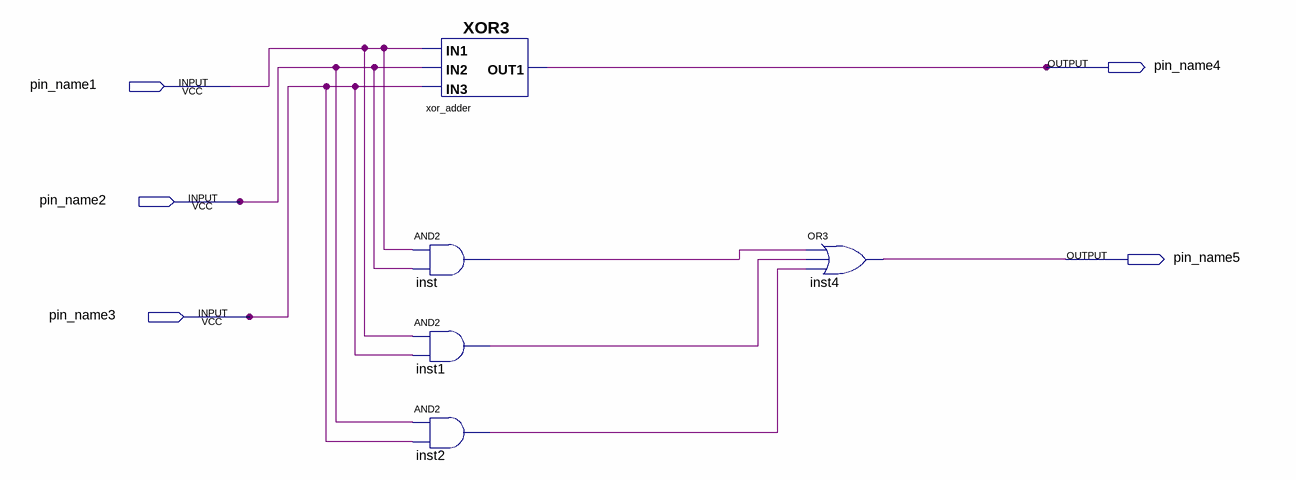
[diagram p0: schematic sheet]
// Quartus schematic full_adder_one_bit.bdf as structural Verilog: 5 symbols, 5 pins
module full_adder_one_bit (
  input  pin_name1,
  input  pin_name2,
  input  pin_name3,
  output pin_name4,
  output pin_name5
);

  wire inst1_out, inst2_out, inst_out;

  XOR3 xor_adder (.IN3(pin_name3), .IN1(pin_name1), .IN2(pin_name2), .OUT1(pin_name4));
  and inst (inst_out, pin_name1, pin_name2);
  and inst1 (inst1_out, pin_name1, pin_name3);
  and inst2 (inst2_out, pin_name2, pin_name3);
  or inst4 (pin_name5, inst_out, inst1_out, inst2_out);
endmodule
